# Altium project BB_PowerSupply.PrjPcb
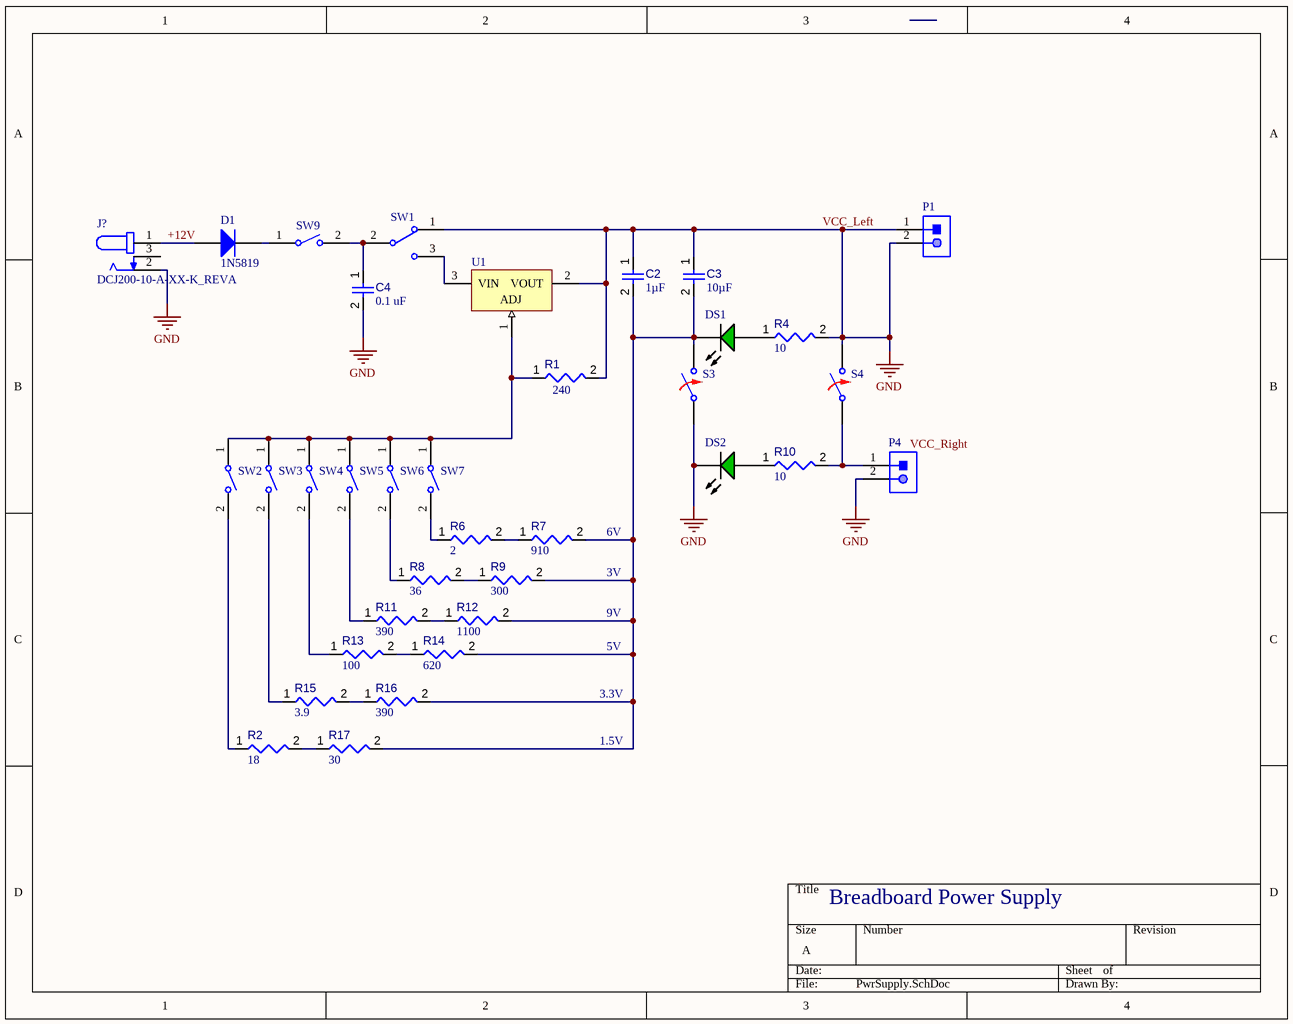
[diagram p0: PwrSupply.SchDoc]
Title: Breadboard Power Supply
1 sheet, 35 parts. Net scope: global (net labels, ports and power ports of the same name join across sheets).
Board file: BB_PowerSupply_Module.PcbDoc

## Sheet PwrSupply.SchDoc: Breadboard Power Supply Module
size A; SheetNumber: 1; SheetTotal: 1

### Parts
C2  value 1µF  [CAPC1608X90X35ML15T15]  (hidden comment: Capacitor 1uF +/- 10% 16V 0603)
C3  value 10µF  [CAPC1608X90X35ML15T15]  (hidden comment: Capacitor 1uF +/- 10% 16V 0603)
C4  value 0.1 uF  [CAPC0402(1005)33_L]  (hidden comment: Capacitor 680pF +/-20% 50V 0402)
D1  1N5819  [ONSC-AXIAL_LEAD-2-59-10_P]
DS1  (no value)  [CGX-G502DC]
DS2  (no value)  [CGX-G502DC]
J?  DCJ200-10-A-XX-K_REVA  [GCT_DCJ200-10-A-XX-K_REVA]
P1  (no value)  [JST-S2B-XH-A(LF)(SN)_V]
P4  (no value)  [JST-S2B-XH-A(LF)(SN)_V]
R1  value 240  [RESC0402(1005)_L]  (hidden comment: Resistor 10R  +/-1 % 0402 63 mW)
R2  value 18  [RESC0402(1005)_L]  (hidden comment: Resistor 10R  +/-1 % 0402 63 mW)
R4  value 10  [RESC0402(1005)_L]  (hidden comment: Resistor 10R  +/-1 % 0402 63 mW)
R6  value 2  [RESC0402(1005)_L]  (hidden comment: Resistor 10R  +/-1 % 0402 63 mW)
R7  value 910  [RESC0402(1005)_L]  (hidden comment: Resistor 10R  +/-1 % 0402 63 mW)
R8  value 36  [RESC0402(1005)_L]  (hidden comment: Resistor 10R  +/-1 % 0402 63 mW)
R9  value 300  [RESC0402(1005)_L]  (hidden comment: Resistor 10R  +/-1 % 0402 63 mW)
R10  value 10  [RESC0402(1005)_L]  (hidden comment: Resistor 10R  +/-1 % 0402 63 mW)
R11  value 390  [RESC0402(1005)_L]  (hidden comment: Resistor 10R  +/-1 % 0402 63 mW)
R12  value 1100  [RESC0402(1005)_L]  (hidden comment: Resistor 10R  +/-1 % 0402 63 mW)
R13  value 100  [RESC0402(1005)_L]  (hidden comment: Resistor 10R  +/-1 % 0402 63 mW)
R14  value 620  [RESC0402(1005)_L]  (hidden comment: Resistor 10R  +/-1 % 0402 63 mW)
R15  value 3.9  [RESC0402(1005)_L]  (hidden comment: Resistor 10R  +/-1 % 0402 63 mW)
R16  value 390  [RESC0402(1005)_L]  (hidden comment: Resistor 10R  +/-1 % 0402 63 mW)
R17  value 30  [RESC0402(1005)_L]  (hidden comment: Resistor 10R  +/-1 % 0402 63 mW)
S3  Switch Normally Opened  (value not drawn)
S4  Switch Normally Opened  (value not drawn)
SW1  (no value)  [ESWI-EG1218_V]
SW2  (no value)  [OMRON-B3U-3000P_V]
SW3  (no value)  [OMRON-B3U-3000P_V]
SW4  (no value)  [OMRON-B3U-3000P_V]
SW5  (no value)  [OMRON-B3U-3000P_V]
SW6  (no value)  [OMRON-B3U-3000P_V]
SW7  (no value)  [OMRON-B3U-3000P_V]
SW9  (no value)  [OMRON-B3U-3000P_V]
U1  (no value)  [ONSC-TO-220-3-221AB-01]

### Nets
VCC_Left: C2.1 C3.1 C4.2 DS2.2(K) J?.2 P1.1 P1.2 P4.2 R1.2 R4.2 S3.1 S4.2 SW1.1 U1.2(VOUT)  [also labelled GND]
+12V: D1.1(A) J?.1
NetC2_2: C2.2 C3.2 DS1.2(K) R7.2 R9.2 R12.2 R14.2 R16.2 R17.2 S3.2
NetC4_1: C4.1 SW1.2(COM) SW9.2
NetD1_2: D1.2(K) SW9.1
NetDS1_1: DS1.1(A) R4.1
NetDS2_1: DS2.1(A) R10.1
NetP4_1: P4.1 R10.2 S4.1
NetR1_1: R1.1 SW2.1 SW3.1 SW4.1 SW5.1 SW6.1 SW7.1 U1.1(ADJ)
NetR2_1: R2.1 SW2.2
NetR2_2: R2.2 R17.1
NetR6_1: R6.1 SW7.2
NetR6_2: R6.2 R7.1
NetR8_1: R8.1 SW6.2
NetR8_2: R8.2 R9.1
NetR11_1: R11.1 SW5.2
NetR11_2: R11.2 R12.1
NetR13_1: R13.1 SW4.2
NetR13_2: R13.2 R14.1
NetR15_1: R15.1 SW3.2
NetR15_2: R15.2 R16.1
NetSW1_3: SW1.3 U1.3(VIN)

Not connected (* = marked no-connect by the designer): J? 3

### Notes on the sheet
- (near R7) 6V
- (near R7) 3V
- 9V
- 3.3V
- 5V
- 1.5V
- Breadboard Power Supply
- Labels drawn without touching a wire or pin: VCC_Right

### Library data of the parts
C2 C3 = CMP-001-00004-6: Chip Capacitor, 1 uF, +/- 10%, 16 V, 0603 (1608 Metric); Capacitor Type: Ceramic; Mounting Technology: SM; RoHS Compliant: True; Min Operating Temperature: -55°C; Case/Package: 0603; Pins: 2; Voltage Rating: 16V; Max Operating Temperature: 125°C; Tolerance: 10%
C4 = CMP-001-00070-3: Chip Capacitor, 680pF +/-20%, 50V, 0402, Thickness 0.33 mm; Tolerance: 10%; Max Operating Temperature: 85°C; Pins: 2; Min Operating Temperature: -55°C; Voltage Rating: 50V; Mounting Technology: SMT; Case/Package: 0402
D1 = CMP-004-00009-2: Low Drop Power Schottky Rectifier, 40 V, 1 A, 2-Pin DO-41, RoHS; Manufacturer: ON Semiconductor; Max Surge Current: 25A; Forward Current: 1A; Package Version: Rev. U, 02/2005; Peak Reverse Current: 1mA; Max Operating Temperature: 125°C; Case/Package: DO; Package URL: http://www.onsemi.cn/pub_link/Collateral/59-10.PDF; Packaging: Bulk; Manufacturer URL: http://www.onsemi.com/; Min Operating Temperature: -65°C; Package Description: 2-Pin, Axial Lead, Diameter 2.35 mm; Mounting Technology: TH; Datasheet URL: http://www.onsemi.cn/pub_link/Collateral/1N5817-D.PDF; Datasheet Version: Rev. 10, 07/2006; Package Reference: AXIAL_LEAD-2-59-10; Pins: 2; RoHS Compliant: True
DS1 DS2 = CMP-007-00008-2: Green LED, 80 mW, 20 mA, -25 to 85 degC, 2-Pin THD; Manufacturer: Shenzhen CGX; Mounting Technology: TH; Package Reference: G502DC; Datasheet Version: Sep-14; Manufacturer URL: http://szcgx.com/; Package Description: 2-Pin Through Hole Device, Dia 5.9 mm; Datasheet URL: http://datasheet.octopart.com/G502DC-Chengguangxing-datasheet-62330340.pdf; Case/Package: G502DC; RoHS Compliant: Unknown
J? = CMP-002-00071-1: Power Barrel Connector Jack 2.05mm ID (0.081), 5.50mm OD (0.217) Through Hole, Right Angle; MP: DCJ200-10-A-K1-K; MF: Global Connector Technology; Value: *; Source: DCJ200-10-A-XX-K_REVA.SchLib; Pins: 3; SnapEDA_Link: https://www.snapeda.com/parts/DCJ200-10-A-K1-K/Global+Connector+Technology/view-part/?ref=snap; Case/Package: None; Component Type: Standard; Check_prices: https://www.snapeda.com/parts/DCJ200-10-A-K1-K/Global+Connector+Technology/view-part/?ref=eda; Design Item ID: DCJ200-10-A-XX-K_REVA
P1 P4 = CMP-002-00032-2: Male Header, Pitch 2.5 mm, 1 x 2 Position, Height 6.1 mm, Tail Length 3.4 mm, -25 to 85 degC, RoHS, Bulk; Manufacturer: JST; Case/Package: S2B-XH-A(LF)(SN); Package Description: XH Series Disconnectable Crimp Style Connector, Pitch 2.5 mm, 1 x 2 Position, Height 6.1 mm, Tail Length 3.4 mm; Manufacturer URL: http://www.jst.com/home2.html; Datasheet URL: http://www.jst-mfg.com/product/pdf/eng/eXH.pdf; Connector Type: Header; Package Reference: S2B-XH-A(LF)(SN); Mounting Technology: TH; Max Operating Temperature: 85°C; Min Operating Temperature: -25°C; Datasheet Version: May-16; Gender: Male; RoHS Compliant: Unknown
R1 R2 R4 R6-R17 = CMP-009-00152-3: Chip Resistor, 10 Ohms, +/-1 %, 63 mW, -55 to 155 degC, 0402; Tolerance: 1%; Power: 63mW; Pins: 2; Max Operating Temperature: 155°C; Min Operating Temperature: -55°C; Case/Package: 0402
S3 S4 = SW NO: closed: 0; Rclosed: 1m; Ropen: 1Meg; SimulationGenericComponent: True
SW1 = CMP-011-00006-2: Slide Switch, SPDT, 500 V, -20 to 70 degC, 3-Pin THD, RoHS, Bulk; Manufacturer: E-Switch; Voltage Rating (DC): 30V; Current Rating: 200mA; Operating Force: 250gf; Package Quantity: 1000; Contact Plating: Silver; Max Operating Temperature: 70°C; Min Operating Temperature: -20°C; Contact Material: Copper; Datasheet URL: https://www.e-switch.com/system/asset/product_line/data_sheet/119/EG.pdf; Contact Finish: Silver; Case/Package: EG1218; Voltage Rating (AC): 30V; Datasheet Version: Oct-15; Package Description: 3-Pin Through Hole Device, Body 11.6 x 4 mm, Pitch 2.5 mm; RoHS Compliant: True; Package Reference: EG1218; Manufacturer URL: http://www.e-switch.ch/en/; Throw Configuration: SPDT; Contact Current Rating: 200mA; Mounting Technology: TH; Packaging: Bulk; Pins: 3
SW2-SW7 SW9 = CMP-011-00005-2: Tactile Switch, SPST-NO, 0.05 A, 12 V, -25 to 70 degC, 2-Pin SMD, RoHS, Tape and Reel; Manufacturer: Omron Electronic Components; Operating Force: 162gf; Voltage Rating (DC): 12V; Current Rating: 50mA; IP Rating: IP40; Throw Configuration: SPST; Max Contact Resistance: 100mohm; RoHS Compliant: True; Contact Current Rating: 50mA; Manufacturer URL: http://www.omron.com/; Packaging: TapeandReel; Max Voltage Rating (DC): 12V; Contact Material: Silver; Datasheet Version: Jan-15; Package Reference: B3U-3000P; Package Description: 2-Pin Surface Mount Device, Body 4 x 3.2 mm; Min Operating Temperature: -25°C; Package Quantity: 4000; Max Operating Temperature: 70°C; Max Current Rating: 50mA; Voltage Rating: 12V; Case/Package: B3U-3000P; Mounting Technology: SM; Datasheet URL: https://www.omron.com/ecb/products/pdf/en-b3u.pdf
U1 = CMP-019-00023-3: Adjustable Output, Positive Voltage Regulator, 1.5 A, 0 to 125 degC, 3-Pin TO-220 (221AB-01), Pb-Free, Rail; Manufacturer: ON Semiconductor; Outputs: 1; Max Input Voltage: 40V; Min Input Voltage: 4.2V; Output Current: 1.5A; Output Voltage: 1.2V; Package Version: Rev. A, 11/2010; Mounting Technology: TH; Case/Package: TO-220; Package Description: 3-Pin Flange Mount, Vertical Straight Lead, Body 9.97 x 4.445 mm, Pitch 2.54 mm; Package Reference: TO-220-3-221AB-01; Manufacturer URL: http://www.onsemi.com/; Package Quantity: 50; Datasheet Version: Rev. 14, 01/2016; Max Ouput Current: 1.5A; Min Operating Temperature: 0°C; Packaging: Rail/Tube; Datasheet URL: http://www.onsemi.com/pub_link/Collateral/LM317-D.PDF; Max Operating Temperature: 125°C; RoHS Compliant: True; Pins: 3